# Altium project SE842170260.PRJPCB (part 2 of 2)

## Sheet CE842170260_SHEET4.SchDoc
size Tabloid; SheetNumber: 4; SheetTotal: 4; PageSetup: Record=PageOptions|CenterHorizontal=True|CenterVertical=True|PrintScale=0.70|XCorrection=1.00|YCorrection=1.00|PrintKind=1|BorderSize=5000000|LeftOffset=0|BottomOffset=0|Orientation=2|PaperLength=1000|PaperWidth=1000|Scale=100|PaperSource=7|PrintQuality=-4|MediaType=1|DitherType=10|PaperKind=8 1/2x11|PrintScaleMode=1; SPICEModelCacheMIYJXAQF: <root> / <DocumentId>MIYJXAQF</DocumentId> / </root>
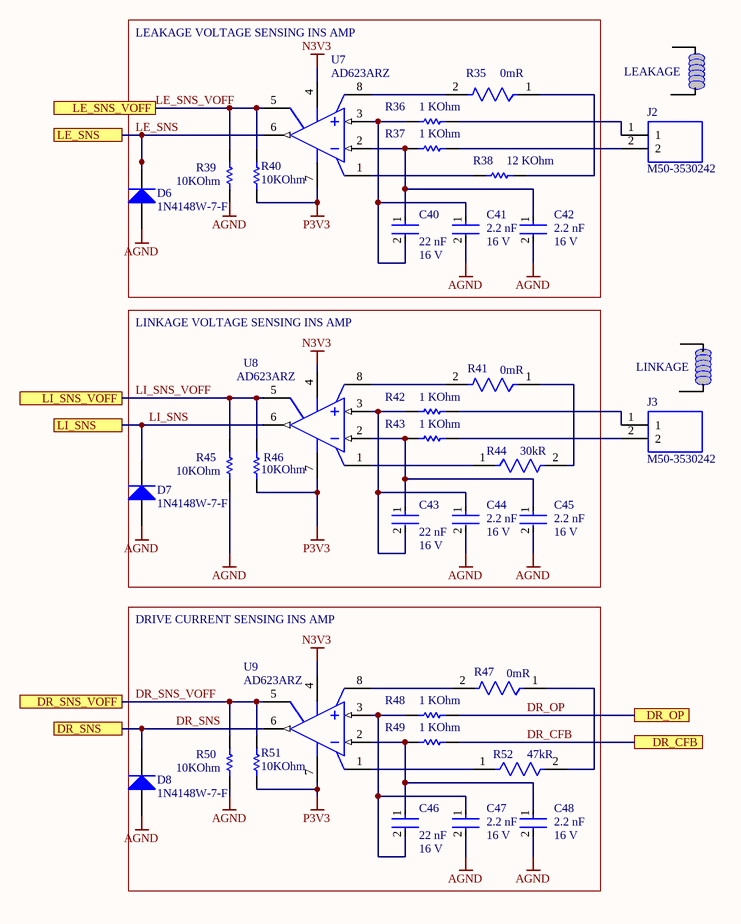
[diagram p3: CE842170260_SHEET4.SchDoc]

### Parts
C40  Voltage Rating: 16 V  Capacitance: 22 nF  [FP-CC0402-MFG]  (hidden comment: CC0402KRX7R7BB223)
C41  Capacitance: 2.2 nF  Voltage Rating: 16 V  [FP-CC0402-MFG]  (hidden comment: CC0402KRX7R7BB222)
C42  Capacitance: 2.2 nF  Voltage Rating: 16 V  [FP-CC0402-MFG]  (hidden comment: CC0402KRX7R7BB222)
C43  Voltage Rating: 16 V  Capacitance: 22 nF  [FP-CC0402-MFG]  (hidden comment: CC0402KRX7R7BB223)
C44  Capacitance: 2.2 nF  Voltage Rating: 16 V  [FP-CC0402-MFG]  (hidden comment: CC0402KRX7R7BB222)
C45  Capacitance: 2.2 nF  Voltage Rating: 16 V  [FP-CC0402-MFG]  (hidden comment: CC0402KRX7R7BB222)
C46  Voltage Rating: 16 V  Capacitance: 22 nF  [FP-CC0402-MFG]  (hidden comment: CC0402KRX7R7BB223)
C47  Capacitance: 2.2 nF  Voltage Rating: 16 V  [FP-CC0402-MFG]  (hidden comment: CC0402KRX7R7BB222)
C48  Capacitance: 2.2 nF  Voltage Rating: 16 V  [FP-CC0402-MFG]  (hidden comment: CC0402KRX7R7BB222)
D6  1N4148W-7-F  [DIOD-SOD123-2_V]
D7  1N4148W-7-F  [DIOD-SOD123-2_V]
D8  1N4148W-7-F  [DIOD-SOD123-2_V]
J2  M50-3530242  [HDRV2W40P0X127_1X2_254X210X420P]
J3  M50-3530242  [HDRV2W40P0X127_1X2_254X210X420P]
R35  Resistance: 0mR  [FP-MCS0402-MFG]  (hidden comment: MCS04020Z0000ZE000)
R36  Resistance: 1 KOhm  [RESC1005X40X25NL05T05]  (hidden comment: ERJ-2RKF1001X)
R37  Resistance: 1 KOhm  [RESC1005X40X25NL05T05]  (hidden comment: ERJ-2RKF1001X)
R38  Resistance: 12 KOhm  [RESC1005X40X25ML05T05]  (hidden comment: ERJ-2RKF1202X)
R39  Resistance: 10KOhm  [RESC1005X40X25LL05T05]  (hidden comment: ERJ2RKF1002X)
R40  Resistance: 10KOhm  [RESC1005X40X25LL05T05]  (hidden comment: ERJ2RKF1002X)
R41  Resistance: 0mR  [FP-MCS0402-MFG]  (hidden comment: MCS04020Z0000ZE000)
R42  Resistance: 1 KOhm  [RESC1005X40X25NL05T05]  (hidden comment: ERJ-2RKF1001X)
R43  Resistance: 1 KOhm  [RESC1005X40X25NL05T05]  (hidden comment: ERJ-2RKF1001X)
R44  Resistance: 30kR  [FP-ERJ2RK-IPC_C]  (hidden comment: ERJ-2RKF3002X)
R45  Resistance: 10KOhm  [RESC1005X40X25LL05T05]  (hidden comment: ERJ2RKF1002X)
R46  Resistance: 10KOhm  [RESC1005X40X25LL05T05]  (hidden comment: ERJ2RKF1002X)
R47  Resistance: 0mR  [FP-MCS0402-MFG]  (hidden comment: MCS04020Z0000ZE000)
R48  Resistance: 1 KOhm  [RESC1005X40X25NL05T05]  (hidden comment: ERJ-2RKF1001X)
R49  Resistance: 1 KOhm  [RESC1005X40X25NL05T05]  (hidden comment: ERJ-2RKF1001X)
R50  Resistance: 10KOhm  [RESC1005X40X25LL05T05]  (hidden comment: ERJ2RKF1002X)
R51  Resistance: 10KOhm  [RESC1005X40X25LL05T05]  (hidden comment: ERJ2RKF1002X)
R52  Resistance: 47kR  [FP-ERJ2RK-IPC_B]  (hidden comment: ERJ-2RKF4702X)
U7  AD623ARZ  [ADI-AD623ARZ-8_M]
U8  AD623ARZ  [ADI-AD623ARZ-8_M]
U9  AD623ARZ  [ADI-AD623ARZ-8_M]

### Blocks framed on the sheet
LEAKAGE VOLTAGE SENSING INS AMP: C40-C42 D6 R35-R40 U7
LINKAGE VOLTAGE SENSING INS AMP: C43-C45 D7 R41-R46 U8
DRIVE CURRENT SENSING INS AMP: C46-C48 D8 R47-R52 U9

### Ports
DR_CFB, DR_OP, DR_SNS, DR_SNS_VOFF, LE_SNS, LE_SNS_VOFF, LI_SNS, LI_SNS_VOFF

### Nets
AGND: C41.2 C42.2 C44.2 C45.2 C47.2 C48.2 D6.1(A) D7.1(A) D8.1(A) R39.1 R45.1 R50.1
N3V3: U7.4(-VS) U8.4(-VS) U9.4(-VS)
P3V3: R40.2 R46.2 R51.2 U7.7(+VS) U8.7(+VS) U9.7(+VS)
DR_CFB: R49.1 ; port DR_CFB
DR_OP: R48.1 ; port DR_OP
DR_SNS: D8.2(K) U9.6(OUTPUT) ; port DR_SNS
DR_SNS_VOFF: R50.2 R51.1 U9.5(REF) ; port DR_SNS_VOFF
LE_SNS: D6.2(K) U7.6(OUTPUT) ; port LE_SNS
LE_SNS_VOFF: R39.2 R40.1 U7.5(REF) ; port LE_SNS_VOFF
LI_SNS: D7.2(K) U8.6(OUTPUT) ; port LI_SNS
LI_SNS_VOFF: R45.2 R46.1 U8.5(REF) ; port LI_SNS_VOFF
NetC40_1: C40.1 C42.1 R37.2 U7.2(-IN)
NetC40_2: C40.2 C41.1 R36.2 U7.3(+IN)
NetC43_1: C43.1 C45.1 R43.2 U8.2(-IN)
NetC43_2: C43.2 C44.1 R42.2 U8.3(+IN)
NetC46_1: C46.1 C48.1 R49.2 U9.2(-IN)
NetC46_2: C46.2 C47.1 R48.2 U9.3(+IN)
NetJ2_1: J2.1 R36.1
NetJ2_2: J2.2 R37.1
NetJ3_1: J3.1 R42.1
NetJ3_2: J3.2 R43.1
NetR35_1: R35.1 R38.2
NetR35_2: R35.2 U7.8(+RG)
NetR38_1: R38.1 U7.1(-RG)
NetR41_1: R41.1 R44.2
NetR41_2: R41.2 U8.8(+RG)
NetR44_1: R44.1 U8.1(-RG)
NetR47_1: R47.1 R52.2
NetR47_2: R47.2 U9.8(+RG)
NetR52_1: R52.1 U9.1(-RG)

### Notes on the sheet
- LEAKAGE
- (near J3) LINKAGE
- BH CONFIDENTIAL
- NOTE
- Title:
- Sheet Title:
- Designed:
- Checked:
- Date:
- DRAWN IN ACCORDANCE WITH TECHNOLOGY WORK INSTRUCTIONS W064
- REV
- DATE
- ECR/ECN
- INT'L
- Number:
- Approved:
- FOR LIMITED NEED TO KNOW USE ONLY. NO PARTS OF THIS DOCUMENT MAY BE PRODUCED OR DISCLOSED WITHOUT PRIOR PERMISSION OF BH
- File:
- Sheet:
- of

### Library data of the parts
C40 C43 C46 = CMP-03422-001279-1: CAP CER 0.022UF 16V X7R 0402; Manufacturer: YAGEO; Temperature Coefficient: 30ppm/°C; Value: 22 nF; Automotive Grade: NA; Tolerance: 0.1; Material: Ceramic; RoHS: TRUE; Mouser Description: Multilayer Ceramic Capacitors MLCC - SMD/SMT 22nF 16V X7R 10%; Package: CC0402; Height: 0.55mm; Octopart: https://octopart.com/cc0402krx7r7bb223-yageo-42244626; ComponentLink2URL: http://www.yageo.com/documents/recent/UPY-GP_NP0_16V-to-50V_16.pdf; Lead Free: Yes; Temperature Characteristic: X7R; Ipc Land Pattern Name: CAPC10050X50; Temperature Range High: +125°C; Device Class L3: Ceramic Capacitors; Device Class L2: Capacitors; Device Class L1: Passive Components; ComponentLink2Description: Datasheet; Manufacturer Part Number: CC0402KRX7R7BB223; Automotive: No; Temperature Range Low: -55°C; Footprint Url: http://www.yageo.com/exep/pages/download/literatures/UPY-C_GEN_24.pdf; Category: Cap; Temperature: -55°C to +125°C; Digikey Description: CAP CER 0.022UF 16V X7R 0402
C41 C42 C44 C45 C47 C48 = CMP-03422-000450-1: CAP CER 2200PF 16V X7R 0402; Manufacturer: YAGEO; Value: 2.2 nF; Tolerance: 0.1; Material: Ceramic; Automotive Grade: NA; Temperature Coefficient: 30ppm/°C; Temperature Characteristic: X7R; Octopart: https://octopart.com/cc0402krx7r7bb222-yageo-12817657; Digikey Description: CAP CER 2200PF 16V X7R 0402; Temperature Range High: +125°C; Mouser Description: 0402 2.2 nF 16 V ±10 % Tolerance X7R SMT Multilayer Ceramic Capacitor; ComponentLink2URL: http://www.yageo.com/documents/recent/UPY-GP_NP0_16V-to-50V_16.pdf; Automotive: No; Device Class L3: Ceramic Capacitors; Footprint Url: http://www.yageo.com/exep/pages/download/literatures/UPY-C_GEN_24.pdf; ComponentLink2Description: Datasheet; Lead Free: Yes; Category: Cap; RoHS: TRUE; Temperature Range Low: -55°C; Height: 0.55mm; Manufacturer Part Number: CC0402KRX7R7BB222; Device Class L1: Passive Components; Temperature: -55°C to +125°C; Package: CC0402; Device Class L2: Capacitors; Ipc Land Pattern Name: CAPC10050X50
D6-D8 = CMP-2000-04932-2: Fast Switching Diode, 100 V, 0.15 A, -65 to 150 degC, 2-Pin?SOD123, RoHS, Tape and Reel; Recovery Time: 4ns; Brand: DiodesIncorporated; Unit Weight: 0.000353oz; Max Surge Current: 2A; Peak Reverse Voltage: 100V; Ir - Reverse Current: 1uA; Vf - Forward Voltage: 1.25V; Configuration: Single; If - Forward Current: 0.15A; Product Category: Diodes-GeneralPurpose,Power,Switching; Operating Temperature Range: -65Cto+150C; Packaging: Reel; Manufacturer URL: http://www.diodes.com/; Maximum Operating Temperature: +150C; Height: 1.25mm; Minimum Operating Temperature: -65C; Product: SwitchingDiodes; Package URL: http://www.diodes.com/datasheets/ds18004.pdf; Type: SwitchingDiode; Package Reference: SOD123-2; Width: 1.7mm; Datasheet URL: http://www.farnell.com/datasheets/1915529.pdf; Datasheet Version: Rev. 24-2, 10/2013; Series: 1N4148; Factory Pack Quantity: 3000; Length: 2.85mm; RoHS: True; Manufacturer: DiodesIncorporated; Mounting Style: SMD/SMT; Package / Case: SOD-123
J2 J3 = M50-3530242: Headers & Wire Housings 2 WAY SIL VERT PC TAIL P/HDR; Manufacturer_Name: Harwin; Geometry.Height: 4.2mm; Mouser Part Number: 855-M50-3530242; Mouser Price/Stock: https://www.mouser.co.uk/ProductDetail/Harwin/M50-3530242?qs=%252BdQmOuGyFcFfqfwYQe%2FxZw%3D%3D; Manufacturer_Part_Number: M50-3530242; Datasheet Link: https://cdn.harwin.com/pdfs/M50-353.pdf
R35 R41 R47 = CMP-02407-001042-1: RES SMD 1.2K OHM 1% 1/10W 0402; Voltage Rating: 50V; Max Power Dissipation: 100mW; Composition: Thin Film; Max Operating Temperature: 125°C; Number of Terminations: 2; Mount: Surface Mount; Packaging: Tape and Reel; REACH SVHC: No SVHC; Case Code (Metric): 1005; Package Quantity: 1; Radiation Hardening: No; Termination: Wraparound; Case Code (Imperial): 0402; Contact Plating: Tin; Depth: 0.5mm; Height: 0.015inch; Length: 1mm; Voltage Rating (DC): 50V; Power Rating: 100mW; Lead Free: Lead Free; Min Operating Temperature: -55°C; Military Standard: Not; Width: 0.02inch; Case/Package: 0402
R36 R37 R42 R43 R48 R49 = CMP-1011-00510-4: Chip Resistor, 1 KOhm, +/- 1%, 100 mW, -55 to 155 degC, 0402 (1005 Metric), RoHS, Tape and Reel; Manufacturer: Basic Passives; Voltage Rating: 50 V; Case\/Package: 0402; Power Rating: 100 mW; PartNumber: ERJ-2RKF1001X; DatasheetVersion: 04/2015; Radiation Hardening: No; Pins: 2; Height: 0.35 mm; RoHSCompliant: true; Case Code (Imperial): 0402; ComponentLink2Description: Datasheet; ComponentLink1Description: Manufacturer URL; PackageReference: 0402; Mount: Surface Mount; Package Quantity: 10000; Tolerance: 1%; ComponentLink1URL: http://www.panasonic.com/; PackageDescription: 2-Pin Surface Mount Device, Body 1 x 0.5 mm; Mounting Technology: Surface Mount; Case Code (Metric): 1005; ComponentLink2URL: http://industrial.panasonic.com/cdbs/www-data/pdf/RDA0000/AOA0000C86.pdf; REACH SVHC: Yes; Packaging: Tape and Reel; Max Operating Temperature: 155 degC; Min Operating Temperature: -55 degC; Width: 0.5 mm; Length: 1 mm
R38 = CMP-2002-00646-4: Chip Resistor, 12 KOhm, +/- 1%, 0.1 W, -55 to 155 degC, 0402 (1005 Metric), RoHS, Tape and Reel; Voltage Rating: 50 V; Case\/Package: 0402; Power Rating: 100 mW; Length: 1 mm; PackageReference: 0402; DatasheetVersion: 04/2015; ComponentLink2Description: Datasheet; ComponentLink1URL: http://www.panasonic.com/; Pins: 2; Width: 0.5 mm; REACH SVHC: Yes; Packaging: Tape and Reel; Min Operating Temperature: -55 degC; Mounting Technology: Surface Mount; Max Operating Temperature: 155 degC; Case Code (Imperial): 0402; Height: 0.35 mm; Tolerance: 1%; PackageDescription: 2-Pin Surface Mount Device, Body 1 x 0.5 mm; RoHSCompliant: true; ComponentLink1Description: Manufacturer URL; Mount: Surface Mount; ComponentLink2URL: http://industrial.panasonic.com/cdbs/www-data/pdf/RDA0000/AOA0000C86.pdf; Package Quantity: 10000; Case Code (Metric): 1005; PartNumber: ERJ-2RKF1202X
R39 R40 R45 R46 R50 R51 = CMP-2000-07588-1: Chip Resistor, 10 KOhm, +/- 1%, 0.1 W, -55 to 155 degC, 0402 (1005 Metric), RoHS, Tape and Reel; Manufacturer: Panasonic; Power Rating: 100mW; Voltage Rating: 50V; Case\/Package: 0402; Temperature Coefficient: 100ppm\/degreesC; RoHSCompliant: True; Lead Free: LeadFree; Package Quantity: 1; Contact Plating: Tin; Length: 1mm; Radiation Hardening: No; REACH SVHC: NoSVHC; Max Operating Temperature: 155degC; Depth: 0.5mm; Case Code (Imperial): 0402; Military Standard: Not; Package Description: 2-Pin Surface Mount Device, Body 1 x 0.5 mm; Termination: SMD/SMT; Case Code (Metric): 1005; Height: 0.35mm; Packaging: TapeandReel; Voltage Rating (DC): 50V; Package Reference: 402; Number of Pins: 2; Tolerance: 1%; Mounting Technology: SurfaceMount; Width: 0.02inch; Mount: SurfaceMount; Datasheet URL: https://industrial.panasonic.com/cdbs/www-data/pdf/RDA0000/AOA0000C304.pdf; Composition: ThickFilm; Datasheet Version: 02/2017; Manufacturer URL: http://www.panasonic.com/; Max Power Dissipation: 100mW; Number of Terminations: 2; Min Operating Temperature: -55degC
R44 = CMP-2002-01142-2: RES SMD 30K OHM 1% 1/10W 0402; Voltage Rating: 50V; Temperature Coefficient: 100ppm/°C; Power Rating: 100mW; Depth: 0.5mm; Tolerance: 1%; Length: 1mm; Contact Plating: Tin; Package Quantity: 10000; Resistance Tolerance: 1%; Min Operating Temperature: -55°C; Case/Package: 0402; Max Operating Temperature: 155°C; RoHS Compliant: Yes; Case Code (Imperial): 0402; Height: 0.35mm; Military Standard: Not; Technology: THICK FILM; Resistor Type: Thick Film; Termination: SMD/SMT; Voltage Rating (DC): 50V; Mount: Surface Mount; Series: ERJ; Number of Terminations: 2; Packaging: Tape and Reel; Construction: Rectangular; REACH SVHC: No SVHC; Case Code (Metric): 1005; Max Power Dissipation: 100mW; Width: 0.5mm
R52 = CMP-2002-01155-2: RES SMD 47K OHM 1% 1/10W 0402; Voltage Rating: 50V; Power Rating: 100mW; Temperature Coefficient: 100ppm/°C; Contact Plating: Tin; Radiation Hardening: No; Case/Package: 0402; Length: 1mm; Termination: SMD/SMT; RoHS Compliant: Yes; Resistor Type: Thick Film; Voltage Rating (DC): 50V; Depth: 0.5mm; Series: ERJ; Construction: Rectangular; REACH SVHC: No SVHC; Min Operating Temperature: -55°C; Packaging: Tape and Reel; Max Power Dissipation: 100mW; Military Standard: Not; Package Quantity: 1; Resistance Tolerance: 1%; Case Code (Metric): 1005; Technology: THICK FILM; Height: 0.35mm; Max Operating Temperature: 155°C; Number of Pins: 2; Tolerance: 1%; Case Code (Imperial): 0402; Width: 0.5mm; Number of Terminations: 2; Mount: Surface Mount; Features: Automotive AEC-Q200; Lead Free: Lead Free
U7-U9 = CMP-2000-05040-1: Single-Supply, Rail-to-Rail, Low Cost Instrumentation Amplifier, 800 KHz, -40 to 85 degC, 8-Pin SOIC, RoHS, Tube; Manufacturer: Analog Devices; EDA / CAD Models: DownloadfromAcceleratedDesigns; PCN Design/Specification: AD623PolymideThickness02/Oct/2013AD623PolymideThickness15/Oct/2013; -3db Bandwidth: 800kHz; Voltage - Supply, Single/Dual (±): 2.7V~12V,±2.5V~6V; Current - Input Bias: 17nA; Voltage - Input Offset: 25µV; Slew Rate: 0.3V/µs; Current - Supply: 375µA; Mfg Application Notes: Electrocardiogram(ECG)Solutions; Number of Circuits: 1; Product Training Modules: InstrumentationAmplifiersPerformanceCommonPhotodiodeOp-AmpCircuitProblemsandSolutionsIndirectCurrentFeedbackInstrumentationAmplifierApplicationsGuide; Manufacturer URL: http://www.analog.com/; Packaging: Tube; Mounting Type: SurfaceMount; Output Type: Rail-to-Rail; Gain Bandwidth Product: -; Datasheet URL: https://datasheet.ciiva.com/20167/82-1224-20167284.pdf; Current - Output / Channel: -; Standard Package: 98; Supplier Device Package: 8-SOIC; Amplifier Type: Instrumentation; Datasheet Version: Rev. D, 07/2008; Family: Linear-Amplifiers-Instrumentation,OPAmps,BufferAmps; Online Catalog: Instrumentation; Operating Temperature: -40degC~85degC; Category: IntegratedCircuits(ICs); Package / Case: 8-SOIC(0.154",3.90mmWidth); Series: -

## Sheet CE842170260_SHEET5.SchDoc
size Tabloid; SheetNumber: 4; SheetTotal: 4; PageSetup: Record=PageOptions|CenterHorizontal=True|CenterVertical=True|PrintScale=0.70|XCorrection=1.00|YCorrection=1.00|PrintKind=1|BorderSize=5000000|LeftOffset=0|BottomOffset=0|Orientation=2|PaperLength=1000|PaperWidth=1000|Scale=100|PaperSource=7|PrintQuality=-4|MediaType=1|DitherType=10|PaperKind=8 1/2x11|PrintScaleMode=1; SPICEModelCacheMIYJXAQF: <root> / <DocumentId>MIYJXAQF</DocumentId> / </root>
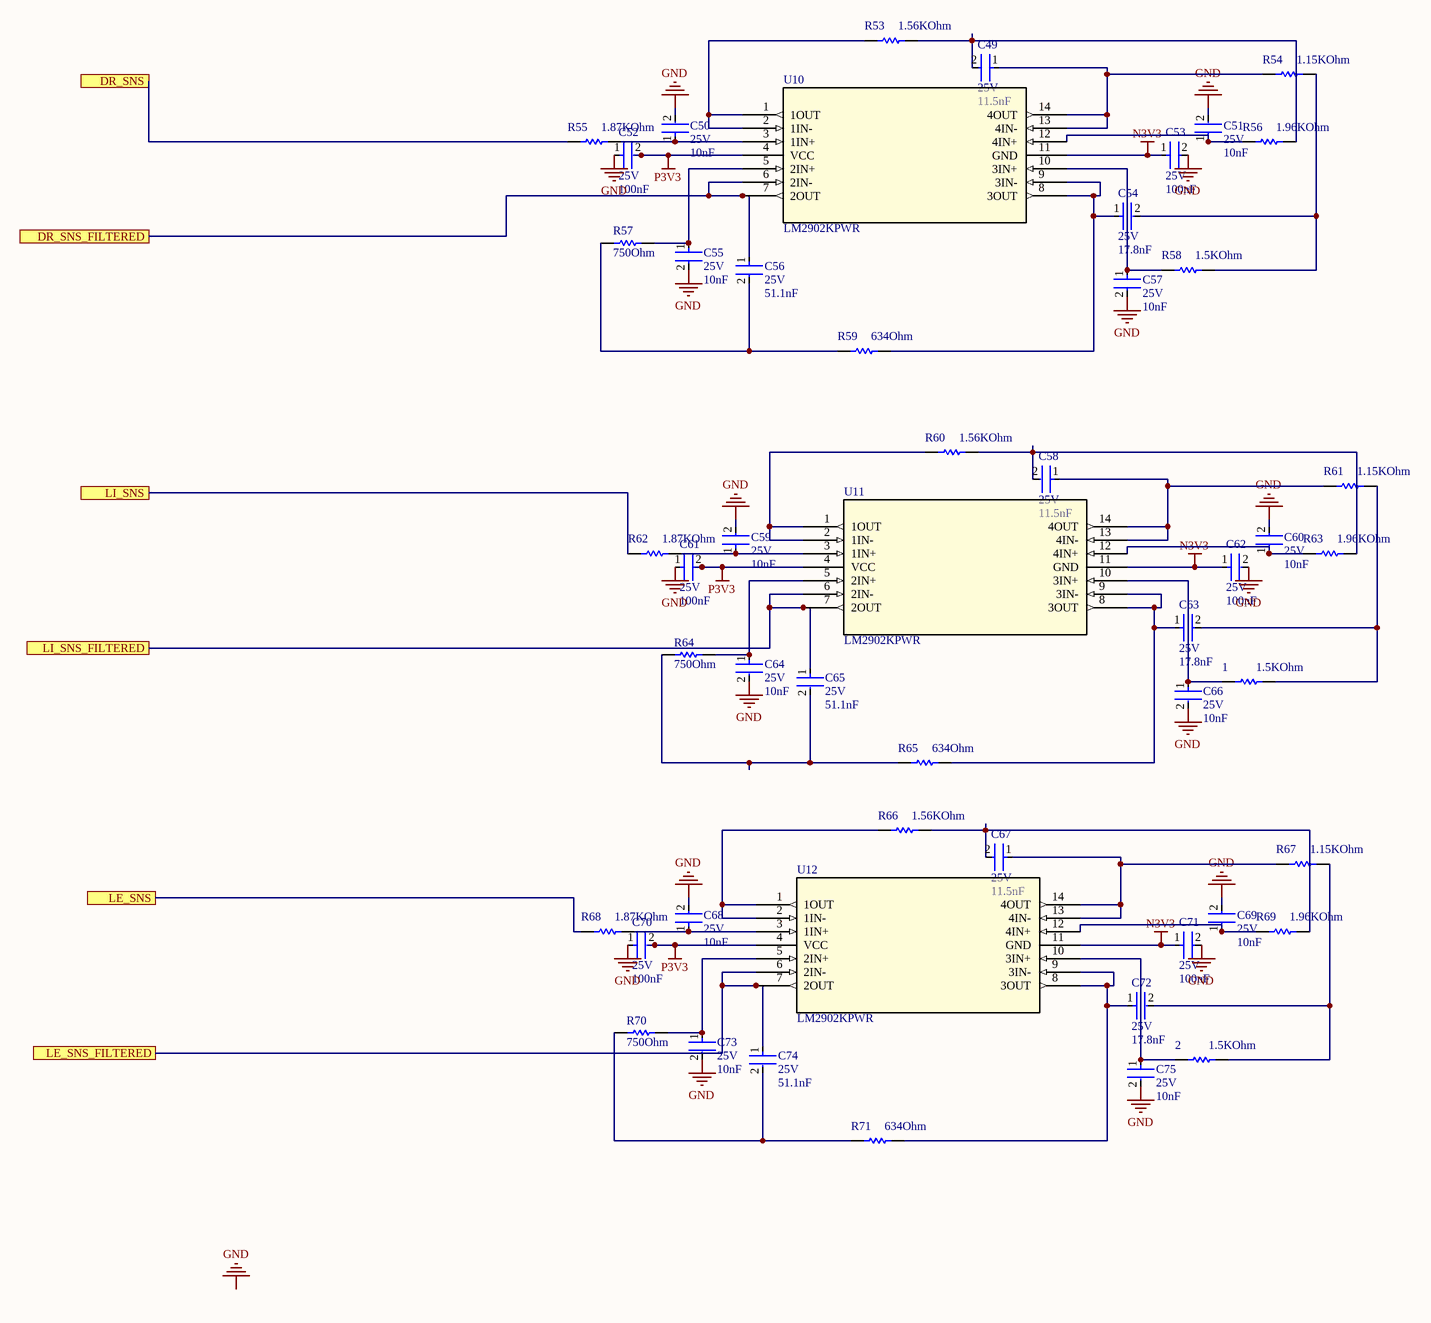
[diagram p4: CE842170260_SHEET5.SchDoc]

### Parts
1  Resistance: 1.5KOhm  [RESC1005X40X25LL05T05]  (hidden comment: ERJ2RKF1002X)
2  Resistance: 1.5KOhm  [RESC1005X40X25LL05T05]  (hidden comment: ERJ2RKF1002X)
C49  Voltage Rating (DC): 25V  Capacitance: 11.5nF  [FP-C1005-050-0_05-MFG]  (hidden comment: C1005X5R1E104K050BC)
C50  Voltage Rating (DC): 25V  Capacitance: 10nF  [FP-C1005-050-0_05-MFG]  (hidden comment: C1005X5R1E104K050BC)
C51  Voltage Rating (DC): 25V  Capacitance: 10nF  [FP-C1005-050-0_05-MFG]  (hidden comment: C1005X5R1E104K050BC)
C52  Voltage Rating (DC): 25V  Capacitance: 100nF  [FP-C1005-050-0_05-MFG]  (hidden comment: C1005X5R1E104K050BC)
C53  Voltage Rating (DC): 25V  Capacitance: 100nF  [FP-C1005-050-0_05-MFG]  (hidden comment: C1005X5R1E104K050BC)
C54  Voltage Rating (DC): 25V  Capacitance: 17.8nF  [FP-C1005-050-0_05-MFG]  (hidden comment: C1005X5R1E104K050BC)
C55  Voltage Rating (DC): 25V  Capacitance: 10nF  [FP-C1005-050-0_05-MFG]  (hidden comment: C1005X5R1E104K050BC)
C56  Voltage Rating (DC): 25V  Capacitance: 51.1nF  [FP-C1005-050-0_05-MFG]  (hidden comment: C1005X5R1E104K050BC)
C57  Voltage Rating (DC): 25V  Capacitance: 10nF  [FP-C1005-050-0_05-MFG]  (hidden comment: C1005X5R1E104K050BC)
C58  Voltage Rating (DC): 25V  Capacitance: 11.5nF  [FP-C1005-050-0_05-MFG]  (hidden comment: C1005X5R1E104K050BC)
C59  Voltage Rating (DC): 25V  Capacitance: 10nF  [FP-C1005-050-0_05-MFG]  (hidden comment: C1005X5R1E104K050BC)
C60  Voltage Rating (DC): 25V  Capacitance: 10nF  [FP-C1005-050-0_05-MFG]  (hidden comment: C1005X5R1E104K050BC)
C61  Voltage Rating (DC): 25V  Capacitance: 100nF  [FP-C1005-050-0_05-MFG]  (hidden comment: C1005X5R1E104K050BC)
C62  Voltage Rating (DC): 25V  Capacitance: 100nF  [FP-C1005-050-0_05-MFG]  (hidden comment: C1005X5R1E104K050BC)
C63  Voltage Rating (DC): 25V  Capacitance: 17.8nF  [FP-C1005-050-0_05-MFG]  (hidden comment: C1005X5R1E104K050BC)
C64  Voltage Rating (DC): 25V  Capacitance: 10nF  [FP-C1005-050-0_05-MFG]  (hidden comment: C1005X5R1E104K050BC)
C65  Voltage Rating (DC): 25V  Capacitance: 51.1nF  [FP-C1005-050-0_05-MFG]  (hidden comment: C1005X5R1E104K050BC)
C66  Voltage Rating (DC): 25V  Capacitance: 10nF  [FP-C1005-050-0_05-MFG]  (hidden comment: C1005X5R1E104K050BC)
C67  Voltage Rating (DC): 25V  Capacitance: 11.5nF  [FP-C1005-050-0_05-MFG]  (hidden comment: C1005X5R1E104K050BC)
C68  Voltage Rating (DC): 25V  Capacitance: 10nF  [FP-C1005-050-0_05-MFG]  (hidden comment: C1005X5R1E104K050BC)
C69  Voltage Rating (DC): 25V  Capacitance: 10nF  [FP-C1005-050-0_05-MFG]  (hidden comment: C1005X5R1E104K050BC)
C70  Voltage Rating (DC): 25V  Capacitance: 100nF  [FP-C1005-050-0_05-MFG]  (hidden comment: C1005X5R1E104K050BC)
C71  Voltage Rating (DC): 25V  Capacitance: 100nF  [FP-C1005-050-0_05-MFG]  (hidden comment: C1005X5R1E104K050BC)
C72  Voltage Rating (DC): 25V  Capacitance: 17.8nF  [FP-C1005-050-0_05-MFG]  (hidden comment: C1005X5R1E104K050BC)
C73  Voltage Rating (DC): 25V  Capacitance: 10nF  [FP-C1005-050-0_05-MFG]  (hidden comment: C1005X5R1E104K050BC)
C74  Voltage Rating (DC): 25V  Capacitance: 51.1nF  [FP-C1005-050-0_05-MFG]  (hidden comment: C1005X5R1E104K050BC)
C75  Voltage Rating (DC): 25V  Capacitance: 10nF  [FP-C1005-050-0_05-MFG]  (hidden comment: C1005X5R1E104K050BC)
R53  Resistance: 1.56KOhm  [RESC1005X40X25LL05T05]  (hidden comment: ERJ2RKF1002X)
R54  Resistance: 1.15KOhm  [RESC1005X40X25LL05T05]  (hidden comment: ERJ2RKF1002X)
R55  Resistance: 1.87KOhm  [RESC1005X40X25LL05T05]  (hidden comment: ERJ2RKF1002X)
R56  Resistance: 1.96KOhm  [RESC1005X40X25LL05T05]  (hidden comment: ERJ2RKF1002X)
R57  Resistance: 750Ohm  [RESC1005X40X25LL05T05]  (hidden comment: ERJ2RKF1002X)
R58  Resistance: 1.5KOhm  [RESC1005X40X25LL05T05]  (hidden comment: ERJ2RKF1002X)
R59  Resistance: 634Ohm  [RESC1005X40X25LL05T05]  (hidden comment: ERJ2RKF1002X)
R60  Resistance: 1.56KOhm  [RESC1005X40X25LL05T05]  (hidden comment: ERJ2RKF1002X)
R61  Resistance: 1.15KOhm  [RESC1005X40X25LL05T05]  (hidden comment: ERJ2RKF1002X)
R62  Resistance: 1.87KOhm  [RESC1005X40X25LL05T05]  (hidden comment: ERJ2RKF1002X)
R63  Resistance: 1.96KOhm  [RESC1005X40X25LL05T05]  (hidden comment: ERJ2RKF1002X)
R64  Resistance: 750Ohm  [RESC1005X40X25LL05T05]  (hidden comment: ERJ2RKF1002X)
R65  Resistance: 634Ohm  [RESC1005X40X25LL05T05]  (hidden comment: ERJ2RKF1002X)
R66  Resistance: 1.56KOhm  [RESC1005X40X25LL05T05]  (hidden comment: ERJ2RKF1002X)
R67  Resistance: 1.15KOhm  [RESC1005X40X25LL05T05]  (hidden comment: ERJ2RKF1002X)
R68  Resistance: 1.87KOhm  [RESC1005X40X25LL05T05]  (hidden comment: ERJ2RKF1002X)
R69  Resistance: 1.96KOhm  [RESC1005X40X25LL05T05]  (hidden comment: ERJ2RKF1002X)
R70  Resistance: 750Ohm  [RESC1005X40X25LL05T05]  (hidden comment: ERJ2RKF1002X)
R71  Resistance: 634Ohm  [RESC1005X40X25LL05T05]  (hidden comment: ERJ2RKF1002X)
U10  LM2902KPWR  [PW14]
U11  LM2902KPWR  [PW14]
U12  LM2902KPWR  [PW14]

### Ports
DR_SNS, DR_SNS_FILTERED, LE_SNS, LE_SNS_FILTERED, LI_SNS, LI_SNS_FILTERED

### Nets
GND: C50.2 C51.2 C52.1 C53.2 C55.2 C57.2 C59.2 C60.2 C61.1 C62.2 C64.2 C66.2 C68.2 C69.2 C70.1 C71.2 C73.2 C75.2
N3V3: C53.1 C62.1 C71.1 U10.11(GND) U11.11(GND) U12.11(GND)
P3V3: C52.2 C61.2 C70.2 U10.4(VCC) U11.4(VCC) U12.4(VCC)
DR_SNS: R55.1 ; port DR_SNS
DR_SNS: C56.1 U10.6(2IN-) U10.7(2OUT) ; port DR_SNS_FILTERED  [a separate net that carries the same name]
LE_SNS: R68.1 ; port LE_SNS
LE_SNS: C74.1 U12.6(2IN-) U12.7(2OUT) ; port LE_SNS_FILTERED  [a separate net that carries the same name]
LI_SNS: C65.1 U11.6(2IN-) U11.7(2OUT) ; port LI_SNS_FILTERED
LI_SNS: R62.1 ; port LI_SNS  [a separate net that carries the same name]
Net1_1: 1.1 C66.1 U11.10(3IN+)
Net1_2: 1.2 C63.2 R61.2
Net2_1: 2.1 C75.1 U12.10(3IN+)
Net2_2: 2.2 C72.2 R67.2
NetC49_1: C49.1 R54.1 U10.13(4IN-) U10.14(4OUT)
NetC49_2: C49.2 R53.2 R56.2
NetC50_1: C50.1 R55.2 U10.3(1IN+)
NetC51_1: C51.1 R56.1 U10.12(4IN+)
NetC54_1: C54.1 R59.2 U10.8(3OUT) U10.9(3IN-)
NetC54_2: C54.2 R54.2 R58.2
NetC55_1: C55.1 R57.1 U10.5(2IN+)
NetC56_2: C56.2 R57.2 R59.1
NetC57_1: C57.1 R58.1 U10.10(3IN+)
NetC58_1: C58.1 R61.1 U11.13(4IN-) U11.14(4OUT)
NetC58_2: C58.2 R60.2 R63.2
NetC59_1: C59.1 R62.2 U11.3(1IN+)
NetC60_1: C60.1 R63.1 U11.12(4IN+)
NetC63_1: C63.1 R65.2 U11.8(3OUT) U11.9(3IN-)
NetC64_1: C64.1 R64.1 U11.5(2IN+)
NetC65_2: C65.2 R64.2 R65.1
NetC67_1: C67.1 R67.1 U12.13(4IN-) U12.14(4OUT)
NetC67_2: C67.2 R66.2 R69.2
NetC68_1: C68.1 R68.2 U12.3(1IN+)
NetC69_1: C69.1 R69.1 U12.12(4IN+)
NetC72_1: C72.1 R71.2 U12.8(3OUT) U12.9(3IN-)
NetC73_1: C73.1 R70.1 U12.5(2IN+)
NetC74_2: C74.2 R70.2 R71.1
NetR53_1: R53.1 U10.1(1OUT) U10.2(1IN-)
NetR60_1: R60.1 U11.1(1OUT) U11.2(1IN-)
NetR66_1: R66.1 U12.1(1OUT) U12.2(1IN-)

### Notes on the sheet
- Labels drawn without touching a wire or pin: GND
- BH CONFIDENTIAL
- NOTE
- Title:
- Sheet Title:
- Designed:
- Checked:
- Date:
- DRAWN IN ACCORDANCE WITH TECHNOLOGY WORK INSTRUCTIONS W064
- REV
- DATE
- ECR/ECN
- INT'L
- Number:
- Approved:
- FOR LIMITED NEED TO KNOW USE ONLY. NO PARTS OF THIS DOCUMENT MAY BE PRODUCED OR DISCLOSED WITHOUT PRIOR PERMISSION OF BH
- File:
- Sheet:
- of

### Library data of the parts
1 2 R53-R71 = CMP-2000-07588-1: as R39 on sheet CE842170260_SHEET4; RoHSCompliant: True; Lead Free: LeadFree; Package Quantity: 1; Contact Plating: Tin; Length: 1mm; Radiation Hardening: No; REACH SVHC: NoSVHC; Max Operating Temperature: 155degC; Depth: 0.5mm; Case Code (Imperial): 0402; Military Standard: Not; Package Description: 2-Pin Surface Mount Device, Body 1 x 0.5 mm; Termination: SMD/SMT; Case Code (Metric): 1005; Height: 0.35mm; Packaging: TapeandReel; Voltage Rating (DC): 50V; Package Reference: 402; Number of Pins: 2; Tolerance: 1%; Mounting Technology: SurfaceMount; Width: 0.02inch; Mount: SurfaceMount; Datasheet URL: https://industrial.panasonic.com/cdbs/www-data/pdf/RDA0000/AOA0000C304.pdf; Composition: ThickFilm; Datasheet Version: 02/2017; Manufacturer URL: http://www.panasonic.com/; Max Power Dissipation: 100mW; Number of Terminations: 2; Min Operating Temperature: -55degC
C49-C75 = CMP-2000-06000-2: Multilayer Ceramic Capacitors 100nF ±10% 25V X5R SMD 0402; Case Code (Imperial): 0402; Termination: Wraparound; Series: C; Depth: 0.5mm; Contact Plating: Tin; Case Code (Metric): 1005; Dielectric: X5R; Case/Package: 0402; Voltage Rating: 25V; Packaging: Tape and Reel; Thickness: 0.022inch; Dielectric Material: Ceramic; Height: 0.5mm; Weight: 2.3E-05oz; RoHS Compliant: Yes; Width: 0.02inch; Tolerance: 10%; Mount: Surface Mount; Package Quantity: 1; Max Operating Temperature: 85°C; Construction: Flat; Min Operating Temperature: -55°C; REACH SVHC: No SVHC; Resistor Type: Ceramic; Length: 1mm; Lead Free: Lead Free; Voltage: 25V
U10-U12 = LM2902KPWR: No Description Available; Mfr_Name: Texas Instruments; Copyright: Copyright (C) 2023 Ultra Librarian. All rights reserved.; Manufacturer_Part_Number: LM2902KPWR; RefDes: RefDes; Type: DEV

## Sheet CE842170260_SHEET6.SchDoc
size Tabloid; SheetNumber: 4; SheetTotal: 4; PageSetup: Record=PageOptions|CenterHorizontal=True|CenterVertical=True|PrintScale=0.70|XCorrection=1.00|YCorrection=1.00|PrintKind=1|BorderSize=5000000|LeftOffset=0|BottomOffset=0|Orientation=2|PaperLength=1000|PaperWidth=1000|Scale=100|PaperSource=7|PrintQuality=-4|MediaType=1|DitherType=10|PaperKind=8 1/2x11|PrintScaleMode=1; SPICEModelCacheMIYJXAQF: <root> / <DocumentId>MIYJXAQF</DocumentId> / </root>
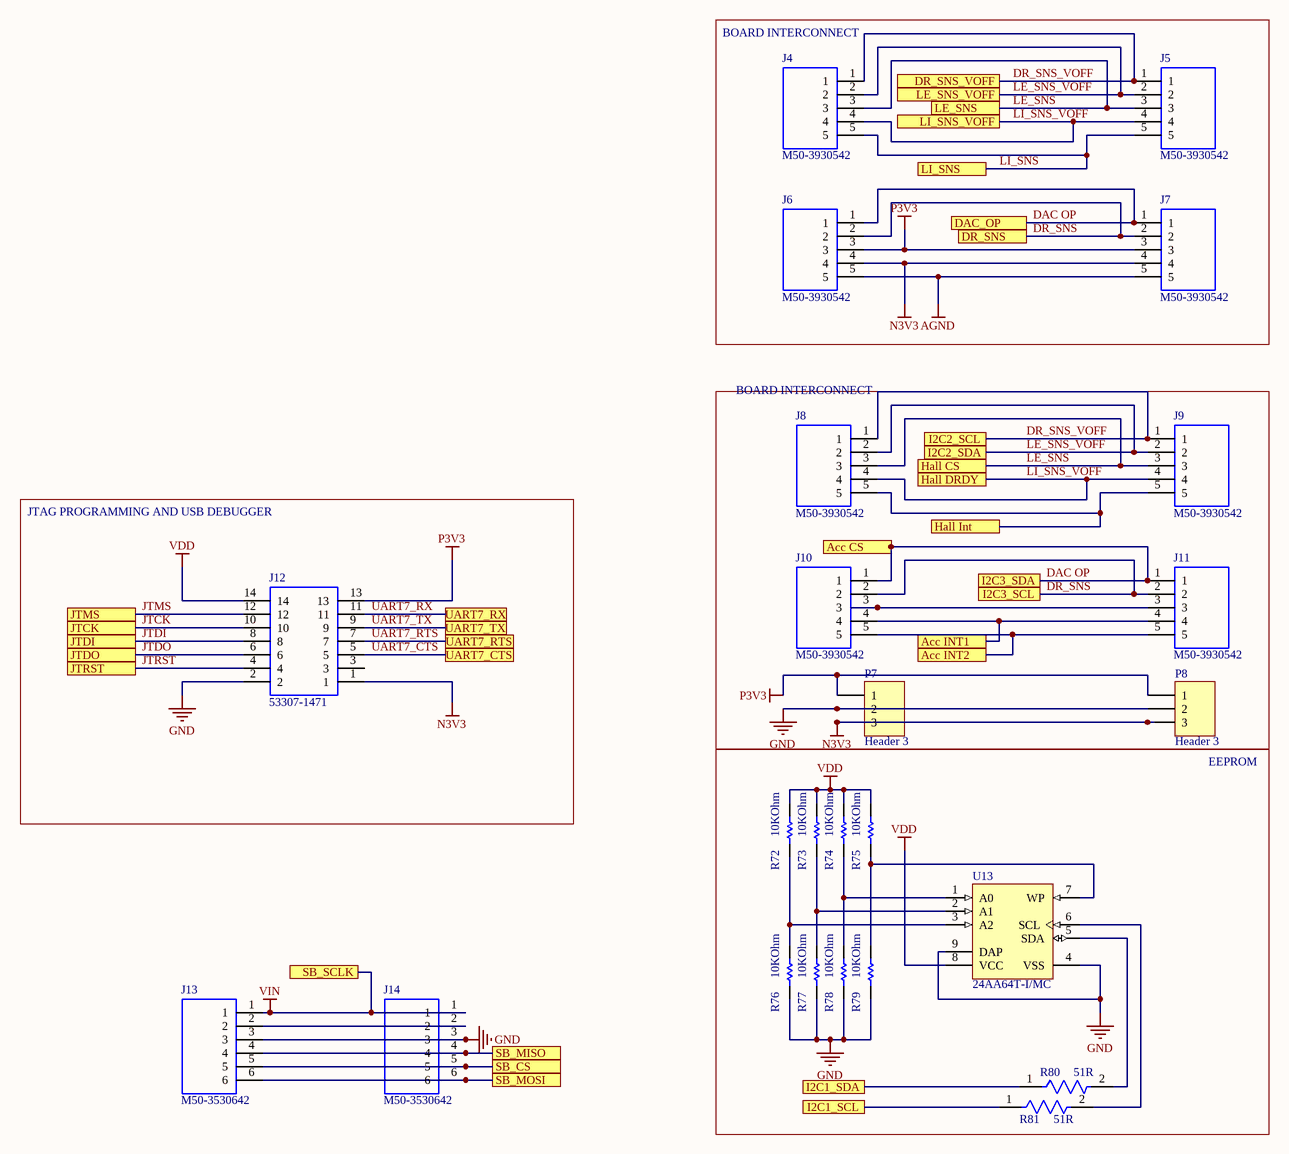
[diagram p5: CE842170260_SHEET6.SchDoc]

### Parts
J4  M50-3930542  [M50-3930542]
J5  M50-3930542  [M50-3930542]
J6  M50-3930542  [M50-3930542]
J7  M50-3930542  [M50-3930542]
J8  M50-3930542  [M50-3930542]
J9  M50-3930542  [M50-3930542]
J10  M50-3930542  [M50-3930542]
J11  M50-3930542  [M50-3930542]
J12  53307-1471  [533071471]
J13  M50-3530642  [HDRV6W30P0X127_1X6_762X210X430P]
J14  M50-3530642  [HDRV6W30P0X127_1X6_762X210X430P]
P7  Header 3  [HDR1X3]
P8  Header 3  [HDR1X3]
R72  Resistance: 10KOhm  [RESC1005X40X25LL05T05]  (hidden comment: ERJ2RKF1002X)
R73  Resistance: 10KOhm  [RESC1005X40X25LL05T05]  (hidden comment: ERJ2RKF1002X)
R74  Resistance: 10KOhm  [RESC1005X40X25LL05T05]  (hidden comment: ERJ2RKF1002X)
R75  Resistance: 10KOhm  [RESC1005X40X25LL05T05]  (hidden comment: ERJ2RKF1002X)
R76  Resistance: 10KOhm  [RESC1005X40X25LL05T05]  (hidden comment: ERJ2RKF1002X)
R77  Resistance: 10KOhm  [RESC1005X40X25LL05T05]  (hidden comment: ERJ2RKF1002X)
R78  Resistance: 10KOhm  [RESC1005X40X25LL05T05]  (hidden comment: ERJ2RKF1002X)
R79  Resistance: 10KOhm  [RESC1005X40X25LL05T05]  (hidden comment: ERJ2RKF1002X)
R80  Resistance: 51R  [FP-ERJ2RK-MFG]  (hidden comment: ERJ-2RKF51R0X)
R81  Resistance: 51R  [FP-ERJ2RK-MFG]  (hidden comment: ERJ-2RKF51R0X)
U13  24AA64T-I/MC  [DFN-MC8]

### Blocks framed on the sheet
BOARD INTERCONNECT: J4-J7
BOARD INTERCONNECT: J8-J11 P7 P8
JTAG PROGRAMMING AND USB DEBUGGER: J12
EEPROM: R72-R81 U13

### Ports
Acc CS, Acc INT1, Acc INT2, DAC_OP, DR_SNS, DR_SNS_VOFF, Hall CS, Hall DRDY, Hall Int, I2C1_SCL, I2C1_SDA, I2C2_SCL, I2C2_SDA, I2C3_SCL, I2C3_SDA, JTCK, JTDI, JTDO, JTMS, JTRST, LE_SNS, LE_SNS_VOFF, LI_SNS, LI_SNS_VOFF, SB_CS, SB_MISO, SB_MOSI, SB_SCLK, UART7_CTS, UART7_RTS, UART7_RX, UART7_TX

### Nets
AGND: J6.5 J7.5
GND: J12.2 J13.3 J14.3 P7.2 P8.2 R76.1 R77.1 R78.1 R79.1 U13.4(VSS) U13.9(DAP)
N3V3: J6.4 J7.4 J12.1 P7.3 P8.3
P3V3: J6.3 J7.3 J12.13 P7.1 P8.1
VDD: J12.14 R72.2 R73.2 R74.2 R75.2 U13.8(VCC)
VIN: J13.1 J14.1 ; port SB_SCLK  [project net SB_SCLK]
DAC OP: J6.1 J7.1 J10.1 J11.1 R80.1 ; port I2C1_SDA, port DAC_OP, port Acc CS, port I2C3_SDA
DR_SNS: J6.2 J7.2 J10.2 J11.2 R81.1 ; port DR_SNS, port I2C1_SCL, port I2C3_SCL
DR_SNS_VOFF: J4.1 J5.1 J8.1 J9.1 ; port DR_SNS_VOFF, port I2C2_SCL
JTCK: J12.10 ; port JTCK
JTDI: J12.8 ; port JTDI
JTDO: J12.6 ; port JTDO
JTMS: J12.12 ; port JTMS
JTRST: J12.4 ; port JTRST
LE_SNS: J4.3 J5.3 J8.3 J9.3 ; port LE_SNS, port Hall CS
LE_SNS_VOFF: J4.2 J5.2 J8.2 J9.2 ; port LE_SNS_VOFF, port I2C2_SDA
LI_SNS: J4.5 J5.5 ; port LI_SNS
LI_SNS_VOFF: J4.4 J5.4 J8.4 J9.4 ; port LI_SNS_VOFF, port Hall DRDY
SB_CS: J13.5 J14.5 ; port SB_CS
SB_MISO: J13.4 J14.4 ; port SB_MISO
SB_MOSI: J13.6 J14.6 ; port SB_MOSI
UART7_CTS: J12.5 ; port UART7_CTS
UART7_RTS: J12.7 ; port UART7_RTS
UART7_RX: J12.11 ; port UART7_RX
UART7_TX: J12.9 ; port UART7_TX
NetJ8_5: J8.5 J9.5 ; port Hall Int
NetJ10_3: J10.3 J11.3
NetJ10_4: J10.4 J11.4 ; port Acc INT1
NetJ10_5: J10.5 J11.5 ; port Acc INT2
NetJ13_2: J13.2 J14.2
NetR72_1: R72.1 R76.2 U13.3(A2)
NetR73_1: R73.1 R77.2 U13.2(A1)
NetR74_1: R74.1 R78.2 U13.1(A0)
NetR75_1: R75.1 R79.2 U13.7(WP)
NetR80_2: R80.2 U13.5(SDA)
NetR81_2: R81.2 U13.6(SCL)

Not connected (* = marked no-connect by the designer): J12 3

### Notes on the sheet
- BH CONFIDENTIAL
- NOTE
- Title:
- Sheet Title:
- Designed:
- Checked:
- Date:
- DRAWN IN ACCORDANCE WITH TECHNOLOGY WORK INSTRUCTIONS W064
- REV
- DATE
- ECR/ECN
- INT'L
- Number:
- Approved:
- FOR LIMITED NEED TO KNOW USE ONLY. NO PARTS OF THIS DOCUMENT MAY BE PRODUCED OR DISCLOSED WITHOUT PRIOR PERMISSION OF BH
- File:
- Sheet:
- of

### Library data of the parts
J4-J11 = M50-3930542: 1.27mm (0.05") Pitch SIL Horizontal Throughboard Pin Header, selective gold + tin, 5 contacts; Manufacturer_Name: Harwin; Geometry.Height: 2.3mm; Mouser Part Number: 855-M50-3930542; Mouser Price/Stock: https://www.mouser.co.uk/ProductDetail/Harwin/M50-3930542?qs=%252BdQmOuGyFcFb1vakt822Tg%3D%3D; Manufacturer_Part_Number: M50-3930542; Datasheet Link: https://cdn.harwin.com/pdfs/M50-393.pdf
J12 = 53307-1471: Board to Board & Mezzanine Connectors 0.8 BtB WaferAssy ST SMT 14Ckt EmbsTpPkg; Manufacturer_Name: Molex; Geometry.Height: 3.65mm; Mouser Part Number: 538-53307-1471; Mouser Price/Stock: https://www.mouser.co.uk/ProductDetail/Molex/53307-1471?qs=9BfFgGvh7CdNLBAt%252BUAvBg%3D%3D; Manufacturer_Part_Number: 53307-1471; Datasheet Link: https://www.molex.com/pdm_docs/sd/533071471_sd.pdf
J13 J14 = M50-3530642: Headers & Wire Housings 6 WAY SIL VERT PC TAIL P/HDR; Manufacturer_Name: Harwin; Geometry.Height: 4.3mm; Mouser Part Number: 855-M50-3530642; Mouser Price/Stock: https://www.mouser.co.uk/ProductDetail/Harwin/M50-3530642?qs=%252BdQmOuGyFcHPs2UJx%2F79Cg%3D%3D; Manufacturer_Part_Number: M50-3530642; Datasheet Link: https://cdn.harwin.com/pdfs/M50-353.pdf
P7 P8 = Header 3: Header, 3-Pin; LatestRevisionDate: 17-Jul-2002; LatestRevisionNote: Re-released for DXP Platform.; Publisher: Altium Limited
R72-R79 = CMP-2000-07588-1: as R39 on sheet CE842170260_SHEET4; RoHSCompliant: True; Lead Free: LeadFree; Package Quantity: 1; Contact Plating: Tin; Length: 1mm; Radiation Hardening: No; REACH SVHC: NoSVHC; Max Operating Temperature: 155degC; Depth: 0.5mm; Case Code (Imperial): 0402; Military Standard: Not; Package Description: 2-Pin Surface Mount Device, Body 1 x 0.5 mm; Termination: SMD/SMT; Case Code (Metric): 1005; Height: 0.35mm; Packaging: TapeandReel; Voltage Rating (DC): 50V; Package Reference: 402; Number of Pins: 2; Tolerance: 1%; Mounting Technology: SurfaceMount; Width: 0.02inch; Mount: SurfaceMount; Datasheet URL: https://industrial.panasonic.com/cdbs/www-data/pdf/RDA0000/AOA0000C304.pdf; Composition: ThickFilm; Datasheet Version: 02/2017; Manufacturer URL: http://www.panasonic.com/; Max Power Dissipation: 100mW; Number of Terminations: 2; Min Operating Temperature: -55degC
R80 R81 = CMP-2002-00977-2: RES SMD 51 OHM 1% 1/10W 0402; Power Rating: 100mW; Voltage Rating: 50V; Temperature Coefficient: 100ppm/°C; Case/Package: 0402; Lead Free: Lead Free; Case Code (Metric): 1005; Features: Automotive AEC-Q200; Max Operating Temperature: 155°C; Construction: Rectangular; Termination: SMD/SMT; Package Quantity: 1; Resistor Type: Thick Film; Resistance Tolerance: 1%; Tolerance: 1%; Mount: Surface Mount; Max Power Dissipation: 100mW; Technology: THICK FILM; Contact Plating: Tin; Width: 0.02inch; Case Code (Imperial): 0402; RoHS Compliant: Yes; Number of Terminations: 2; Packaging: Tape and Reel; Military Standard: Not; Length: 1mm; Depth: 0.5mm; Height: 0.35mm; Series: ERJ; Min Operating Temperature: -55°C; Voltage Rating (DC): 50V; REACH SVHC: No SVHC
U13 = CMP-0159-00447-1: 64Kbit, 400kHz, 1.7V, I2C Serial EEPROM, 8-Pin DFN, Industrial Temperature, Tape and Reel; DatasheetVersion: revQ, Jun-2009; PackageReference: DFN-MC8; PackageDescription: 8-Lead Plastic Dual Flat, No Lead Package (MC) - 2x3x0.9mm Body [DFN]; PackageVersion: revBB, Aug-2009

## Nets that join several sheets
AGND: CE842170260_SHEET2 (15 pins), CE842170260_SHEET3 (9 pins), CE842170260_SHEET4 (12 pins), CE842170260_SHEET6 (J6.5 J7.5)
GND: CE842170260_SHEET1 (15 pins), CE842170260_SHEET2 (22 pins), CE842170260_SHEET5 (18 pins), CE842170260_SHEET6 (11 pins)
N3V3: CE842170260_SHEET1 (C6.2 R6.2 U1.6), CE842170260_SHEET3 (5 pins), CE842170260_SHEET4 (U7.4 U8.4 U9.4), CE842170260_SHEET5 (6 pins), CE842170260_SHEET6 (5 pins)
P3V3: CE842170260_SHEET1 (C4.1 L1.1 R2.2 U1.11), CE842170260_SHEET2 (10 pins), CE842170260_SHEET3 (C32.1 C34.1 U5.8 U6.8), CE842170260_SHEET4 (6 pins), CE842170260_SHEET5 (6 pins), CE842170260_SHEET6 (5 pins)
SB_SCLK: CE842170260_SHEET1 (11 pins), CE842170260_SHEET2 (U2.1), CE842170260_SHEET6 (J13.1 J14.1)
VDD: CE842170260_SHEET1 (L1.2), CE842170260_SHEET2 (25 pins), CE842170260_SHEET6 (6 pins)
DAC OP: CE842170260_SHEET2 (8 pins), CE842170260_SHEET3 (R28.1), CE842170260_SHEET6 (5 pins)
DR_CFB: CE842170260_SHEET3 (J1.2 R30.2 U5.5), CE842170260_SHEET4 (R49.1)
DR_OP: CE842170260_SHEET3 (C29.1 R30.1 R31.2 U5.1), CE842170260_SHEET4 (R48.1)
DR_SNS: CE842170260_SHEET2 (5 pins), CE842170260_SHEET4 (D8.2 U9.6), CE842170260_SHEET5 (R55.1), CE842170260_SHEET6 (5 pins)
DR_SNS: CE842170260_SHEET2 (U2.15), CE842170260_SHEET5 (C56.1 U10.6 U10.7)
DR_SNS_VOFF: CE842170260_SHEET2 (R7.1 R11.1 U2.22 U2.46), CE842170260_SHEET4 (R50.2 R51.1 U9.5), CE842170260_SHEET6 (J4.1 J5.1 J8.1 J9.1)
JTCK: CE842170260_SHEET2 (U2.76), CE842170260_SHEET6 (J12.10)
JTDI: CE842170260_SHEET2 (U2.77), CE842170260_SHEET6 (J12.8)
JTDO: CE842170260_SHEET2 (U2.89), CE842170260_SHEET6 (J12.6)
JTMS: CE842170260_SHEET2 (U2.72), CE842170260_SHEET6 (J12.12)
JTRST: CE842170260_SHEET2 (U2.90), CE842170260_SHEET6 (J12.4)
LE_SNS: CE842170260_SHEET2 (U2.68 U3.10), CE842170260_SHEET4 (D6.2 U7.6), CE842170260_SHEET5 (R68.1), CE842170260_SHEET6 (J4.3 J5.3 J8.3 J9.3)
LE_SNS: CE842170260_SHEET2 (U2.17), CE842170260_SHEET5 (C74.1 U12.6 U12.7)
LE_SNS_VOFF: CE842170260_SHEET2 (R8.1 R12.1 U2.24 U2.47), CE842170260_SHEET4 (R39.2 R40.1 U7.5), CE842170260_SHEET6 (J4.2 J5.2 J8.2 J9.2)
LI_SNS: CE842170260_SHEET2 (U2.16), CE842170260_SHEET5 (C65.1 U11.6 U11.7)
LI_SNS: CE842170260_SHEET4 (D7.2 U8.6), CE842170260_SHEET5 (R62.1), CE842170260_SHEET6 (J4.5 J5.5)
LI_SNS_VOFF: CE842170260_SHEET2 (U2.23 U2.69 U3.8), CE842170260_SHEET4 (R45.2 R46.1 U8.5), CE842170260_SHEET6 (J4.4 J5.4 J8.4 J9.4)
NetJ8_5: CE842170260_SHEET2 (U2.70 U3.7), CE842170260_SHEET6 (J8.5 J9.5)
NetJ10_4: CE842170260_SHEET2 (U2.95 U4.11), CE842170260_SHEET6 (J10.4 J11.4)
NetJ10_5: CE842170260_SHEET2 (U2.96 U4.12), CE842170260_SHEET6 (J10.5 J11.5)
SB_CS: CE842170260_SHEET1 (D3.2 P5.1), CE842170260_SHEET2 (U2.3), CE842170260_SHEET6 (J13.5 J14.5)
SB_MISO: CE842170260_SHEET1 (D4.2 P4.1), CE842170260_SHEET2 (U2.4), CE842170260_SHEET6 (J13.4 J14.4)
SB_MOSI: CE842170260_SHEET1 (D2.2 P6.1), CE842170260_SHEET2 (U2.5), CE842170260_SHEET6 (J13.6 J14.6)
UART7_CTS: CE842170260_SHEET2 (U2.40), CE842170260_SHEET6 (J12.5)
UART7_RTS: CE842170260_SHEET2 (U2.39), CE842170260_SHEET6 (J12.7)
UART7_RX: CE842170260_SHEET2 (U2.37), CE842170260_SHEET6 (J12.11)
UART7_TX: CE842170260_SHEET2 (U2.38), CE842170260_SHEET6 (J12.9)

## Assembly variants
Standard: all parts fitted
PCA: all parts fitted